# Altium project thesis_motherboard.PrjPcb
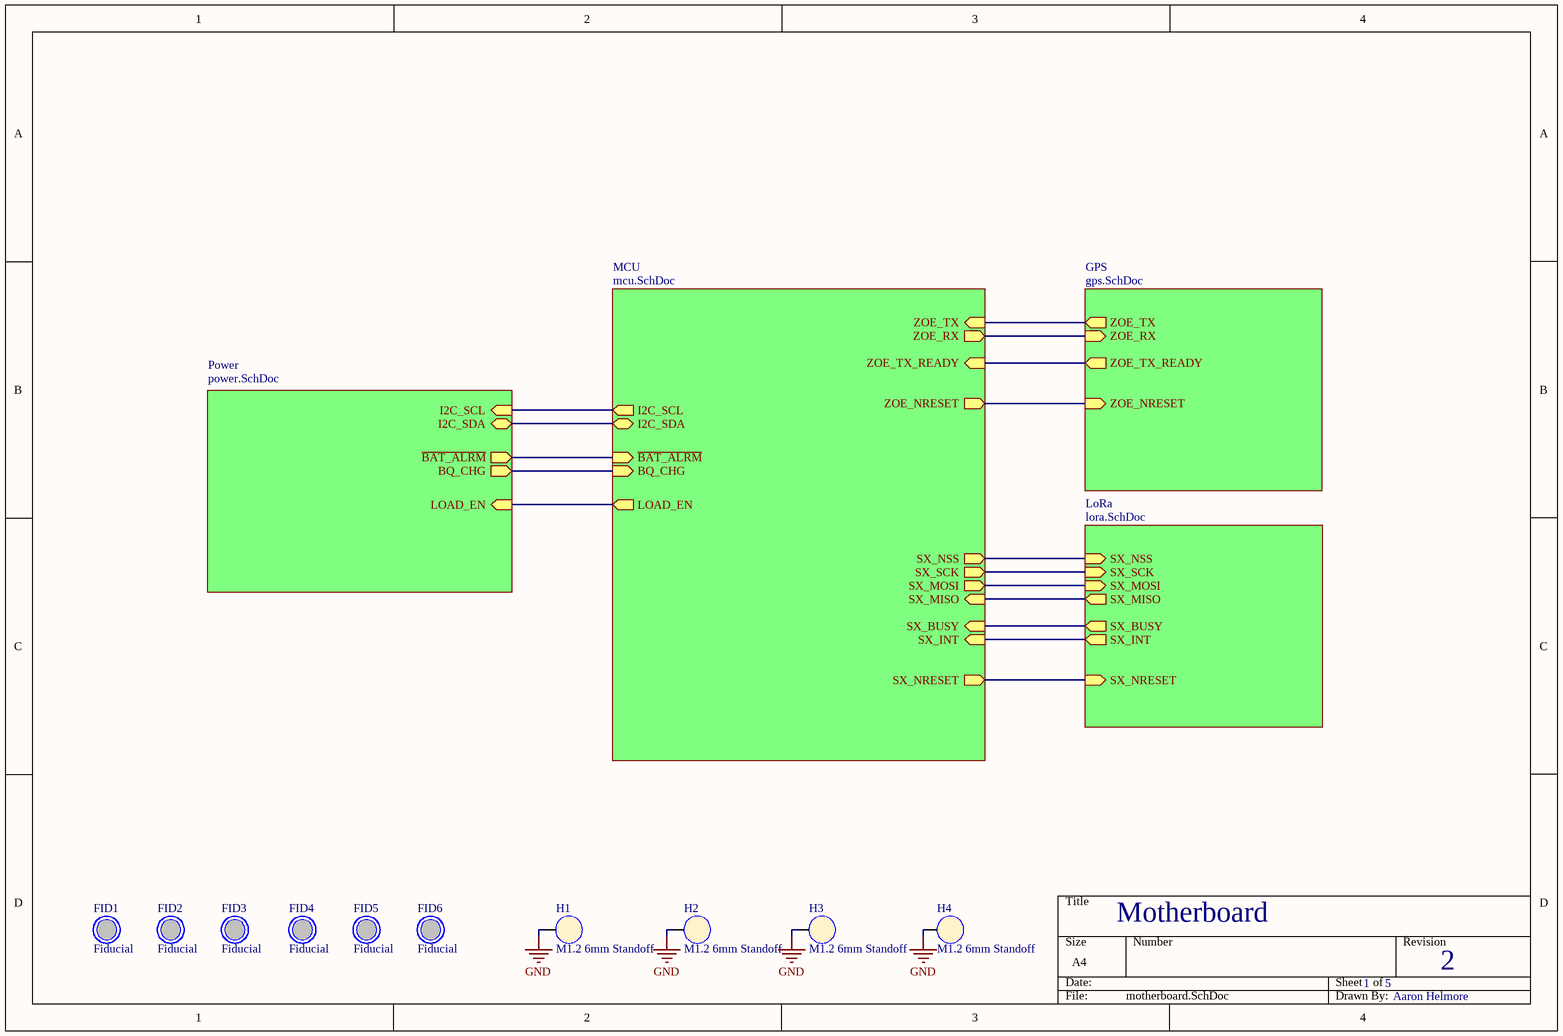
[diagram p0: motherboard.SchDoc]
5 sheets, 94 parts. Net scope: hierarchical (ports join the sheet entries above them; power ports are global).
Board files: motherboard.PcbDoc, motherboardx1.PcbDoc
Sheets:
  motherboard.SchDoc
    MCU = mcu.SchDoc
    GPS = gps.SchDoc
    LoRa = lora.SchDoc
    Power = power.SchDoc

## Sheet motherboard.SchDoc
size A4; DocumentNumber: P21; SheetNumber: 1; SheetTotal: 5

### Parts
FID1  Fiducial  [FIDUCIAL_0.5MM_SOLDER_1MM_MASK]
FID2  Fiducial  [FIDUCIAL_0.5MM_SOLDER_1MM_MASK]
FID3  Fiducial  [FIDUCIAL_0.5MM_SOLDER_1MM_MASK]
FID4  Fiducial  [FIDUCIAL_0.5MM_SOLDER_1MM_MASK]
FID5  Fiducial  [FIDUCIAL_0.5MM_SOLDER_1MM_MASK]
FID6  Fiducial  [FIDUCIAL_0.5MM_SOLDER_1MM_MASK]
H1  M1.2 6mm Standoff  [M1.2_6mm_STANDOFF]
H2  M1.2 6mm Standoff  [M1.2_6mm_STANDOFF]
H3  M1.2 6mm Standoff  [M1.2_6mm_STANDOFF]
H4  M1.2 6mm Standoff  [M1.2_6mm_STANDOFF]

### Sub-sheets
GPS = gps.SchDoc: ZOE_TX (out), ZOE_RX (in), ZOE_TX_READY (out), ZOE_NRESET (in)
LoRa = lora.SchDoc: SX_NSS (in), SX_SCK (in), SX_MOSI (in), SX_MISO (out), SX_BUSY (out), SX_NRESET (in), SX_INT (out)
MCU = mcu.SchDoc: LOAD_EN (out), BQ_CHG (in), ~{BAT_ALRM} (in), I2C_SCL (out), I2C_SDA (bidir), ZOE_TX (in), ZOE_RX (out), ZOE_TX_READY (in), ZOE_NRESET (out), SX_NRESET (out), SX_NSS (out), SX_MOSI (out), SX_SCK (out), SX_MISO (in), SX_BUSY (in), SX_INT (in)
Power = power.SchDoc: BQ_CHG (out), LOAD_EN (in), ~{BAT_ALRM} (out), I2C_SCL (in), I2C_SDA (bidir)

### Nets
GND: H1.1(VCC) H2.1(VCC) H3.1(VCC) H4.1(VCC)
ALRM: sheet MCU/~{BAT_ALRM}, sheet Power/~{BAT_ALRM}
~{CHG}: sheet MCU/BQ_CHG, sheet Power/BQ_CHG
EN: sheet MCU/LOAD_EN, sheet Power/LOAD_EN
HAT_I2C_SCL: sheet MCU/I2C_SCL, sheet Power/I2C_SCL
HAT_I2C_SDA: sheet MCU/I2C_SDA, sheet Power/I2C_SDA
SX_BUSY: sheet MCU/SX_BUSY, sheet LoRa/SX_BUSY
SX_INT: sheet MCU/SX_INT, sheet LoRa/SX_INT
SX_MISO: sheet MCU/SX_MISO, sheet LoRa/SX_MISO
SX_MOSI: sheet MCU/SX_MOSI, sheet LoRa/SX_MOSI
SX_NRESET: sheet MCU/SX_NRESET, sheet LoRa/SX_NRESET
SX_NSS: sheet MCU/SX_NSS, sheet LoRa/SX_NSS
SX_SCK: sheet MCU/SX_SCK, sheet LoRa/SX_SCK
ZOE_NRESET: sheet MCU/ZOE_NRESET, sheet GPS/ZOE_NRESET
ZOE_RX: sheet MCU/ZOE_RX, sheet GPS/ZOE_RX
ZOE_TX: sheet MCU/ZOE_TX, sheet GPS/ZOE_TX
ZOE_TX_READY: sheet MCU/ZOE_TX_READY, sheet GPS/ZOE_TX_READY

### Notes on the sheet
- Motherboard
- 1
- 5
- 2
- Aaron Helmore

## Sheet mcu.SchDoc
size A4; DocumentNumber: P22; SheetNumber: 2; SheetTotal: 5
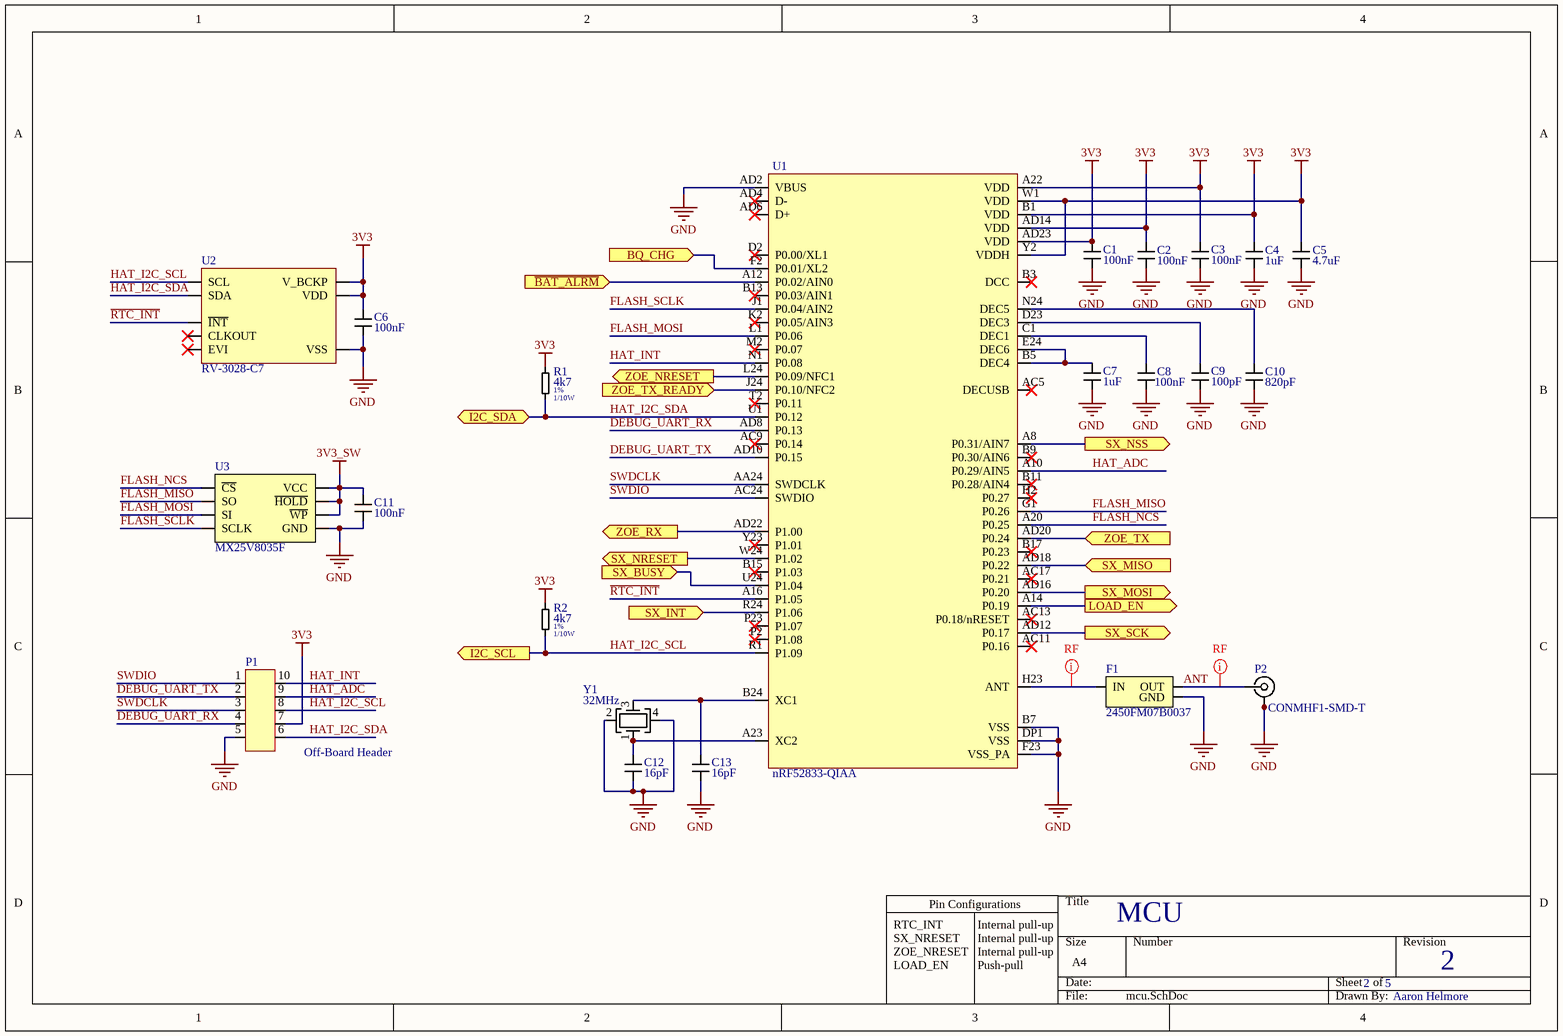
[diagram p1: mcu.SchDoc]

### Parts
C1  100nF  [CAP_0402]
C2  100nF  [CAP_0402]
C3  100nF  [CAP_0402]
C4  1uF  [CAP_0402]
C5  4.7uF  [CAP_0603]
C6  100nF  [CAP_0402]
C7  1uF  [CAP_0402]
C8  100nF  [CAP_0402]
C9  100pF  [CAP_0402]
C10  820pF  [CAP_0402]
C11  100nF  [CAP_0402]
C12  16pF  [CAP_0402]
C13  16pF  [CAP_0402]
F1  2450FM07B0037  [2450FM07B0037]
P1  Off-Board Header  [1_27-5x2-MALE-HEADER]
P2  CONMHF1-SMD-T  [CONMHF1-SMD-T]
R1  4k7  Tolerance: 1%  Wattage: 1/10W  [RES_0402]
R2  4k7  Tolerance: 1%  Wattage: 1/10W  [RES_0402]
U1  nRF52833-QIAA  [nRF52833-QIAA]
U2  RV-3028-C7  [RV-3028-C7]
U3  MX25V8035F  [MX25V8035F]
Y1  32MHz  [4-SMD]

### Ports
BQ_CHG (in), I2C_SCL (out), I2C_SDA (bidir), LOAD_EN (out), SX_BUSY (in), SX_INT (in), SX_MISO (in), SX_MOSI (out), SX_NRESET (out), SX_NSS (out), SX_SCK (out), ZOE_NRESET (out), ZOE_RX (out), ZOE_TX (in), ZOE_TX_READY (in), ~{BAT_ALRM} (in)

### Nets
3V3: C1.2(J11) C2.2(J11) C3.2(J11) C4.2(J11) C5.2(J11) C6.2(J11) P1.7 R1.1 R2.1 U1.A22(VDD) U1.AD14(VDD) U1.AD23(VDD) U1.B1(VDD) U1.W1(VDD) U1.Y2(VDDH) U2.6(V_BCKP) U2.7(VDD)
3V3_SW: C11.2(J11) U3.3(~{WP}) U3.7(~{HOLD}) U3.8(VCC)
GND: C1.1(J12) C2.1(J12) C3.1(J12) C4.1(J12) C5.1(J12) C6.1(J12) C7.1(J12) C8.1(J12) C9.1(J12) C10.1(J12) C11.1(J12) C12.1(J12) C13.1(J12) F1.2(GND) P1.5 P2.2(VCC) P2.3(VCC) P2.4(VCC) U1.AD2(VBUS) U1.B7(VSS) U1.DP1(VSS) U1.F23(VSS_PA) U2.5(VSS) U3.4(GND) Y1.2 Y1.4
ALRM: U1.A12(P0.02/AIN0) ; port ~{BAT_ALRM}
ANT: F1.3(OUT) P2.1(VCC)
~{CHG}: U1.F2(P0.01/XL2) ; port BQ_CHG
DEBUG_UART_RX: P1.4 U1.AD8(P0.13)
DEBUG_UART_TX: P1.2 U1.AD10(P0.15)
EN: U1.A14(P0.19) ; port LOAD_EN
FLASH_MISO: U1.G1(P0.26) U3.2(SO)
FLASH_MOSI: U1.L1(P0.06) U3.5(SI)
FLASH_NCS: U1.A20(P0.25) U3.1(~{CS})
FLASH_SCLK: U1.J1(P0.04/AIN2) U3.6(SCLK)
HAT_ADC: P1.9 U1.A10(P0.29/AIN5)
HAT_I2C_SCL: P1.8 R2.2 U1.R1(P1.09) U2.3(SCL) ; port I2C_SCL
HAT_I2C_SDA: P1.6 R1.2 U1.U1(P0.12) U2.4(SDA) ; port I2C_SDA
HAT_INT: P1.10 U1.N1(P0.08)
~{RTC_INT}: U1.A16(P1.05) U2.2(~{INT})
SWDCLK: P1.3 U1.AA24(SWDCLK)
SWDIO: P1.1 U1.AC24(SWDIO)
SX_BUSY: U1.U24(P1.04) ; port SX_BUSY
SX_INT: U1.R24(P1.06) ; port SX_INT
SX_MISO: U1.AD18(P0.22) ; port SX_MISO
SX_MOSI: U1.AD16(P0.20) ; port SX_MOSI
SX_NRESET: U1.W24(P1.02) ; port SX_NRESET
SX_NSS: U1.A8(P0.31/AIN7) ; port SX_NSS
SX_SCK: U1.AD12(P0.17) ; port SX_SCK
ZOE_NRESET: U1.L24(P0.09/NFC1) ; port ZOE_NRESET
ZOE_RX: U1.AD22(P1.00) ; port ZOE_RX
ZOE_TX: U1.AD20(P0.24) ; port ZOE_TX
ZOE_TX_READY: U1.J24(P0.10/NFC2) ; port ZOE_TX_READY
NetC7_2: C7.2(J11) U1.B5(DEC4) U1.E24(DEC6)
NetC8_2: C8.2(J11) U1.C1(DEC1)
NetC9_2: C9.2(J11) U1.D23(DEC3)
NetC10_2: C10.2(J11) U1.N24(DEC5)
NetC12_2: C12.2(J11) U1.A23(XC2) Y1.1
NetC13_2: C13.2(J11) U1.B24(XC1) Y1.3
NetF1_1: F1.1(IN) U1.H23(ANT)

Not connected (* = marked no-connect by the designer): U1 AC5(DECUSB)* AC9(P0.14)* AC11(P0.16)* AC13(P0.18/nRESET)* AC17(P0.21)* AD4(D-)* AD6(D+)* B3(DCC)* B9(P0.30/AIN6)* B11(P0.28/AIN4)* B13(P0.03/AIN1)* B15(P1.03)* B17(P0.23)* D2(P0.00/XL1)* H2(P0.27)* K2(P0.05/AIN3)* M2(P0.07)* P2(P1.08)* P23(P1.07)* T2(P0.11)* Y23(P1.01)*; U2 1(CLKOUT)* 8(EVI)*

### Layout directives
rule Impedance Constraint [Min = 49.50    Max = 50.50    ]; net class NRF_RF_LINES: ANT, NetF1_1

### Notes on the sheet
- Pin Configurations
- RTC_INT
  SX_NRESET
  ZOE_NRESET
  LOAD_EN
- Internal pull-up
  Internal pull-up
  Internal pull-up
  Push-pull
- MCU
- 2
- 5
- Aaron Helmore

### Library data of the parts
C1-C4 C6-C8 C11 = Capacitor: Dielectric: X5R; Voltage: 25V
C5 = Capacitor: Dielectric: X5R; Voltage: 6.3V
C9 C10 C12 C13 = Capacitor: Dielectric: C0G; Voltage: 50V
F1 = 2450FM07B0037: Miniature 2.4GHz impedance matched low pass filter optimized for nRF52xxx
P1 = CONN_1-27_5x2: 1.27mm pitch 5x2 pin male connector
R1 R2 = R_Small
U1 = nRF52833-QIAA: BLE 5.1, Cortex M-4 SoC
U2 = RV-3028-C7: Extreme Low Power RTC Module
Y1 = Crystal_2_2

## Sheet gps.SchDoc
size A4; DocumentNumber: P24; SheetNumber: 4; SheetTotal: 5
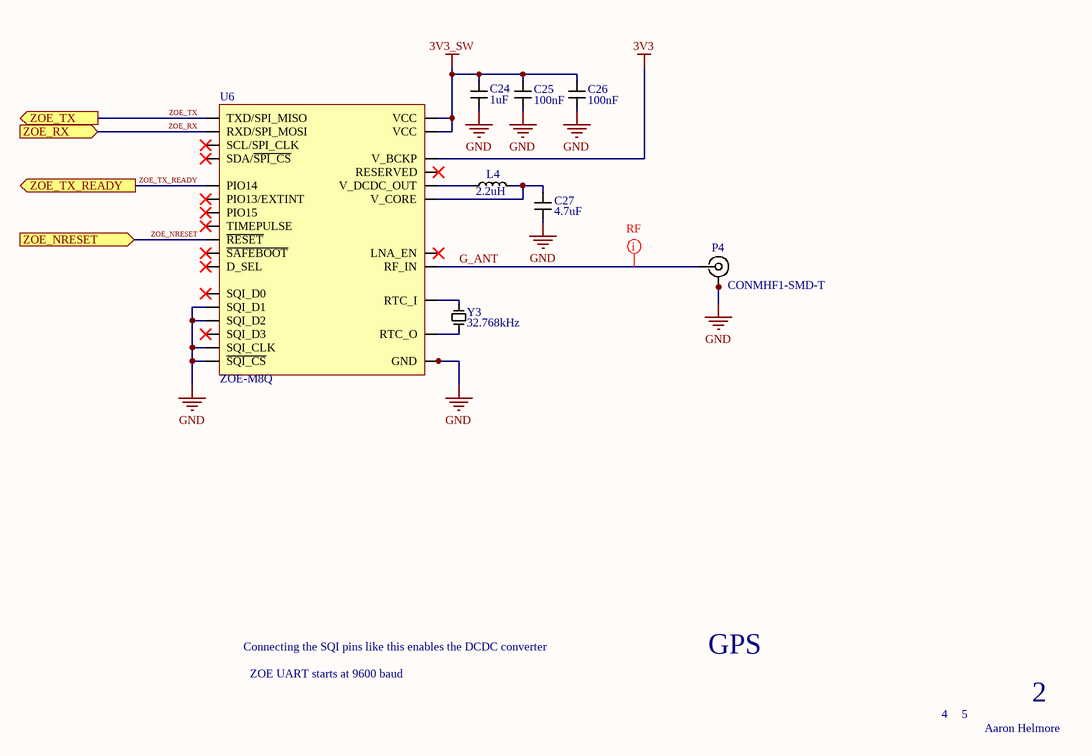
[diagram p2: gps.SchDoc]

### Parts
C24  1uF  [CAP_0402]
C25  100nF  [CAP_0402]
C26  100nF  [CAP_0402]
C27  4.7uF  [CAP_0603]
L4  2.2uH  [LQM2MPNxxxx]
P4  CONMHF1-SMD-T  [CONMHF1-SMD-T]
U6  ZOE-M8Q  [ZOE-M8Q]
Y3  32.768kHz  [2-SMD]

### Ports
ZOE_NRESET (in), ZOE_RX (in), ZOE_TX (out), ZOE_TX_READY (out)

### Nets
3V3: U6.H9(V_BCKP)
3V3_SW: C24.2(J11) C25.2(J11) C26.2(J11) U6.J1(VCC) U6.J2(VCC)
GND: C24.1(J12) C25.1(J12) C26.1(J12) C27.1(J12) P4.2(VCC) P4.3(VCC) P4.4(VCC) U6.A1(GND) U6.A3(GND) U6.A5(GND) U6.A7(GND) U6.A8(GND) U6.A9(GND) U6.B9(GND) U6.C1(SQI_D1) U6.C7(GND) U6.C9(GND) U6.D3(~{SQI_CS}) U6.D6(GND) U6.D9(GND) U6.E1(SQI_CLK) U6.E3(SQI_D2) U6.E7(GND) U6.F7(GND) U6.G3(GND) U6.G6(GND) U6.G7(GND) U6.J3(GND) U6.J9(GND)
G_ANT: P4.1(VCC) U6.A4(RF_IN)
ZOE_NRESET: U6.J6(~{RESET}) ; port ZOE_NRESET
ZOE_RX: U6.J4(RXD/SPI_MOSI) ; port ZOE_RX
ZOE_TX: U6.J5(TXD/SPI_MISO) ; port ZOE_TX
ZOE_TX_READY: U6.F6(PIO14) ; port ZOE_TX_READY
NetC27_2: C27.2(J11) L4.2 U6.G1(V_CORE)
NetL4_1: L4.1 U6.H1(V_DCDC_OUT)
NetU6_J7: U6.J7(RTC_I) Y3.2
NetU6_J8: U6.J8(RTC_O) Y3.1

Not connected (* = marked no-connect by the designer): U6 A2(SDA/~{SPI_CS})* B1(SCL/SPI_CLK)* C3(TIMEPULSE)* C4(~{SAFEBOOT})* C5(LNA_EN)* C6(PIO15)* D1(SQI_D0)* D4(D_SEL)* F3(SQI_D3)* G4(PIO13/EXTINT)* G9(RESERVED)*

### Layout directives
rule Impedance Constraint [Min = 49.50    Max = 50.50    ]; net class ZOE_RF_LINES: G_ANT

### Notes on the sheet
- Connecting the SQI pins like this enables the DCDC converter
- ZOE UART starts at 9600 baud
- GPS
- 4
- 5
- 2
- Aaron Helmore

### Library data of the parts
C24-C26 = Capacitor: Dielectric: X5R; Voltage: 25V
C27 = Capacitor: Dielectric: X5R; Voltage: 6.3V
L4 = Inductor
U6 = ZOE-M8Q: ublox GPS/GNSS receiver
Y3 = Crystal_2_1

## Sheet lora.SchDoc
size A4; DocumentNumber: P23; SheetNumber: 3; SheetTotal: 5
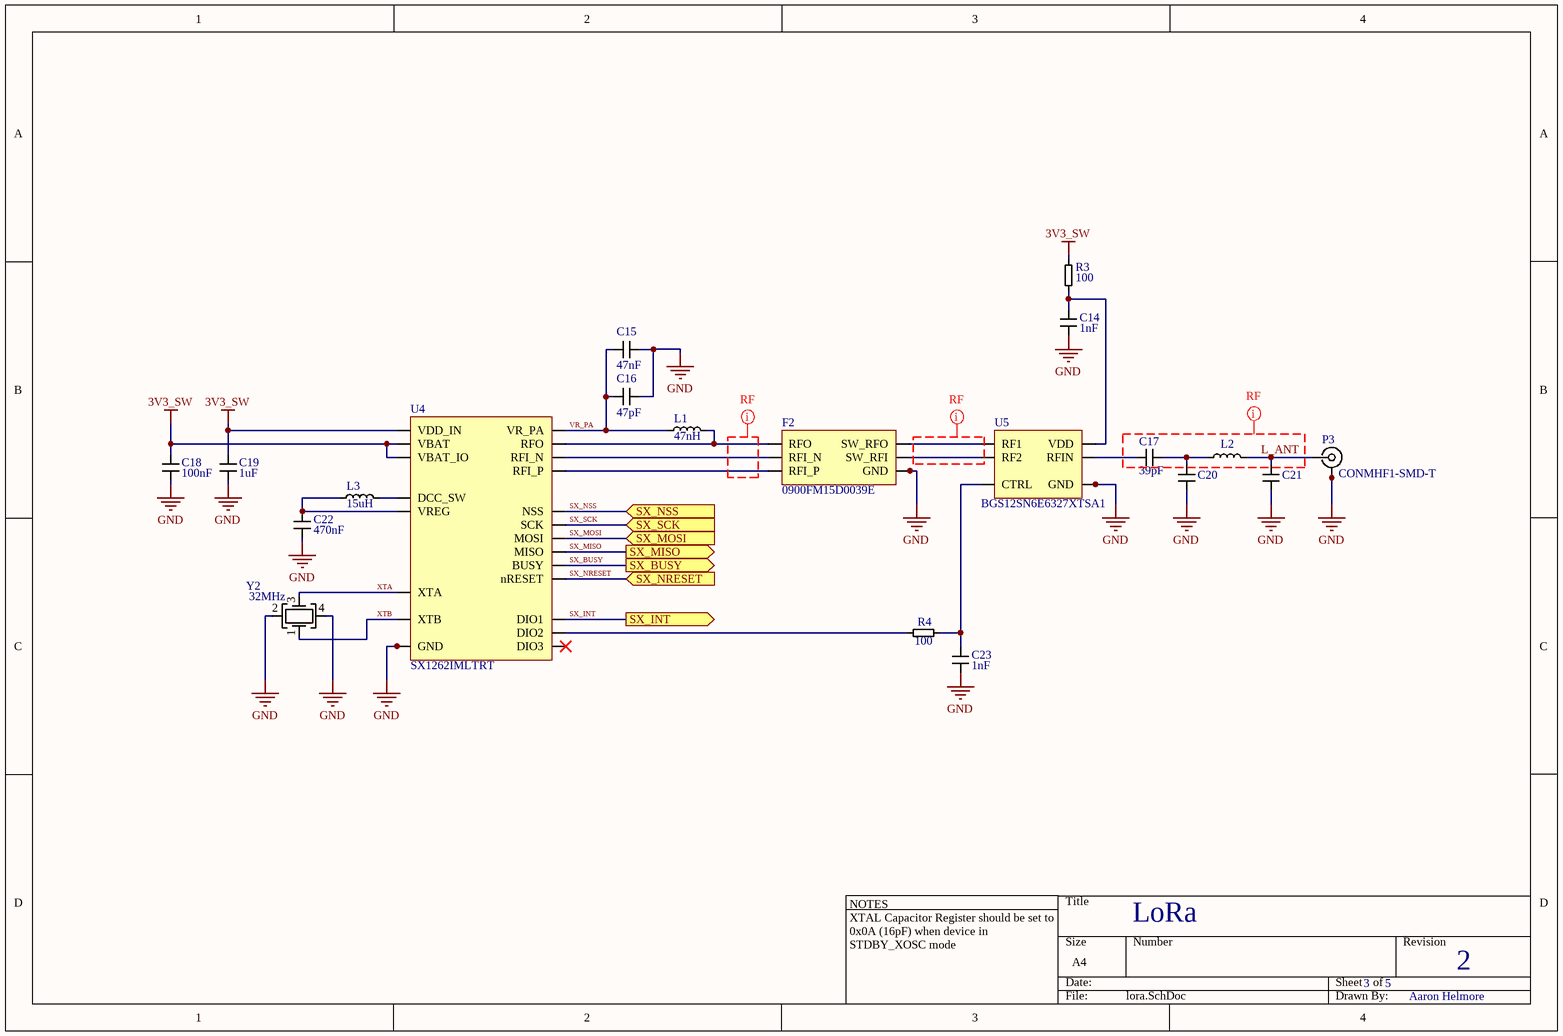
[diagram p3: lora.SchDoc]

### Parts
C14  1nF  [CAP_0402]
C15  47nF  [CAP_0402]
C16  47pF  [CAP_0402]
C17  39pF  [CAP_0402]
C18  100nF  [CAP_0402]
C19  1uF  [CAP_0402]
C20  Capacitor  [CAP_0402]  (value not drawn)
C21  Capacitor  [CAP_0402]  (value not drawn)
C22  470nF  [CAP_0603]
C23  1nF  [CAP_0402]
F2  0900FM15D0039E  [0900FM15D0039E]
L1  47nH  [LQW15AN]
L2  Inductor  [RES_0402]  (value not drawn)
L3  15uH  [VLS2010ET-150M]
P3  CONMHF1-SMD-T  [CONMHF1-SMD-T]
R3  100  [RES_0402]
R4  100  [RES_0402]
U4  SX1262IMLTRT  [SX1262IMLTRT]
U5  BGS12SN6E6327XTSA1  [BGS12SN6E6327XTSA1]
Y2  32MHz  [4-SMD]

### Ports
SX_BUSY (out), SX_INT (out), SX_MISO (out), SX_MOSI (in), SX_NRESET (in), SX_NSS (in), SX_SCK (in)

### Nets
3V3_SW: C18.2(J11) C19.1(J12) R3.1 U4.1(VDD_IN) U4.10(VBAT) U4.11(VBAT_IO)
GND: C14.1(J12) C15.1(J12) C16.1(J12) C18.1(J12) C19.2(J11) C20.1(J12) C21.1(J12) C22.1(J12) C23.1(J12) F2.2(GND) F2.5(GND) F2.7(GND) F2.9(GND) F2.10(GND) P3.2(VCC) P3.3(VCC) P3.4(VCC) U4.0(GND) U4.2(GND) U4.5(GND) U4.8(GND) U4.20(GND) U5.2(GND) Y2.2 Y2.4
L_ANT: C21.2(J11) L2.2 P3.1(VCC)
SX_BUSY: U4.14(BUSY) ; port SX_BUSY
SX_INT: U4.13(DIO1) ; port SX_INT
SX_MISO: U4.16(MISO) ; port SX_MISO
SX_MOSI: U4.17(MOSI) ; port SX_MOSI
SX_NRESET: U4.15(nRESET) ; port SX_NRESET
SX_NSS: U4.19(NSS) ; port SX_NSS
SX_SCK: U4.18(SCK) ; port SX_SCK
VR_PA: C15.2(J11) C16.2(J11) L1.1 U4.24(VR_PA)
XTA: U4.3(XTA) Y2.3
XTB: U4.4(XTB) Y2.1
NetC14_2: C14.2(J11) R3.2 U5.4(VDD)
NetC17_1: C17.1(J12) U5.5(RFIN)
NetC17_2: C17.2(J11) C20.2(J11) L2.1
NetC22_2: C22.2(J11) L3.1 U4.7(VREG)
NetC23_2: C23.2(J11) R4.2 U5.6(CTRL)
NetF2_1: F2.1(RFO) L1.2 U4.23(RFO)
NetF2_3: F2.3(RFI_N) U4.22(RFI_N)
NetF2_4: F2.4(RFI_P) U4.21(RFI_P)
NetF2_6: F2.6(SW_RFI) U5.1(RF2)
NetF2_8: F2.8(SW_RFO) U5.3(RF1)
NetL3_2: L3.2 U4.9(DCC_SW)
NetR4_1: R4.1 U4.12(DIO2)

Not connected (* = marked no-connect by the designer): U4 6(DIO3)*

### Layout directives
rule Impedance Constraint [Min = 49.50    Max = 50.50    ]; net class SX_RF_LINES: (no net found under the mark), L_ANT

### Notes on the sheet
- NOTES
  XTAL Capacitor Register should be set to 0x0A (16pF) when device in STDBY_XOSC mode
- LoRa
- 3
- 5
- 2
- Aaron Helmore

### Library data of the parts
C14 C23 = Capacitor: Dielectric: X7R; Voltage: 50V
C15 C22 = Capacitor: Dielectric: X7R; Voltage: 25V
C16 C17 = Capacitor: Dielectric: C0G; Voltage: 50V
C18 C19 = Capacitor: Dielectric: X5R; Voltage: 25V
F2 = 0900FM15D0039E: Miniature impedance-matched filter for Semtech SX1261/SX1262 for 915MHz operation
L1 L3 = Inductor
R3 R4 = R_Small: Tolerance: 1%; Wattage: 1/4W
U4 = SX1262IMLTRT: Semtech LoRa radio transceivers
Y2 = Crystal_2_2

## Sheet power.SchDoc
size A4; DocumentNumber: P25; SheetNumber: 5; SheetTotal: 5
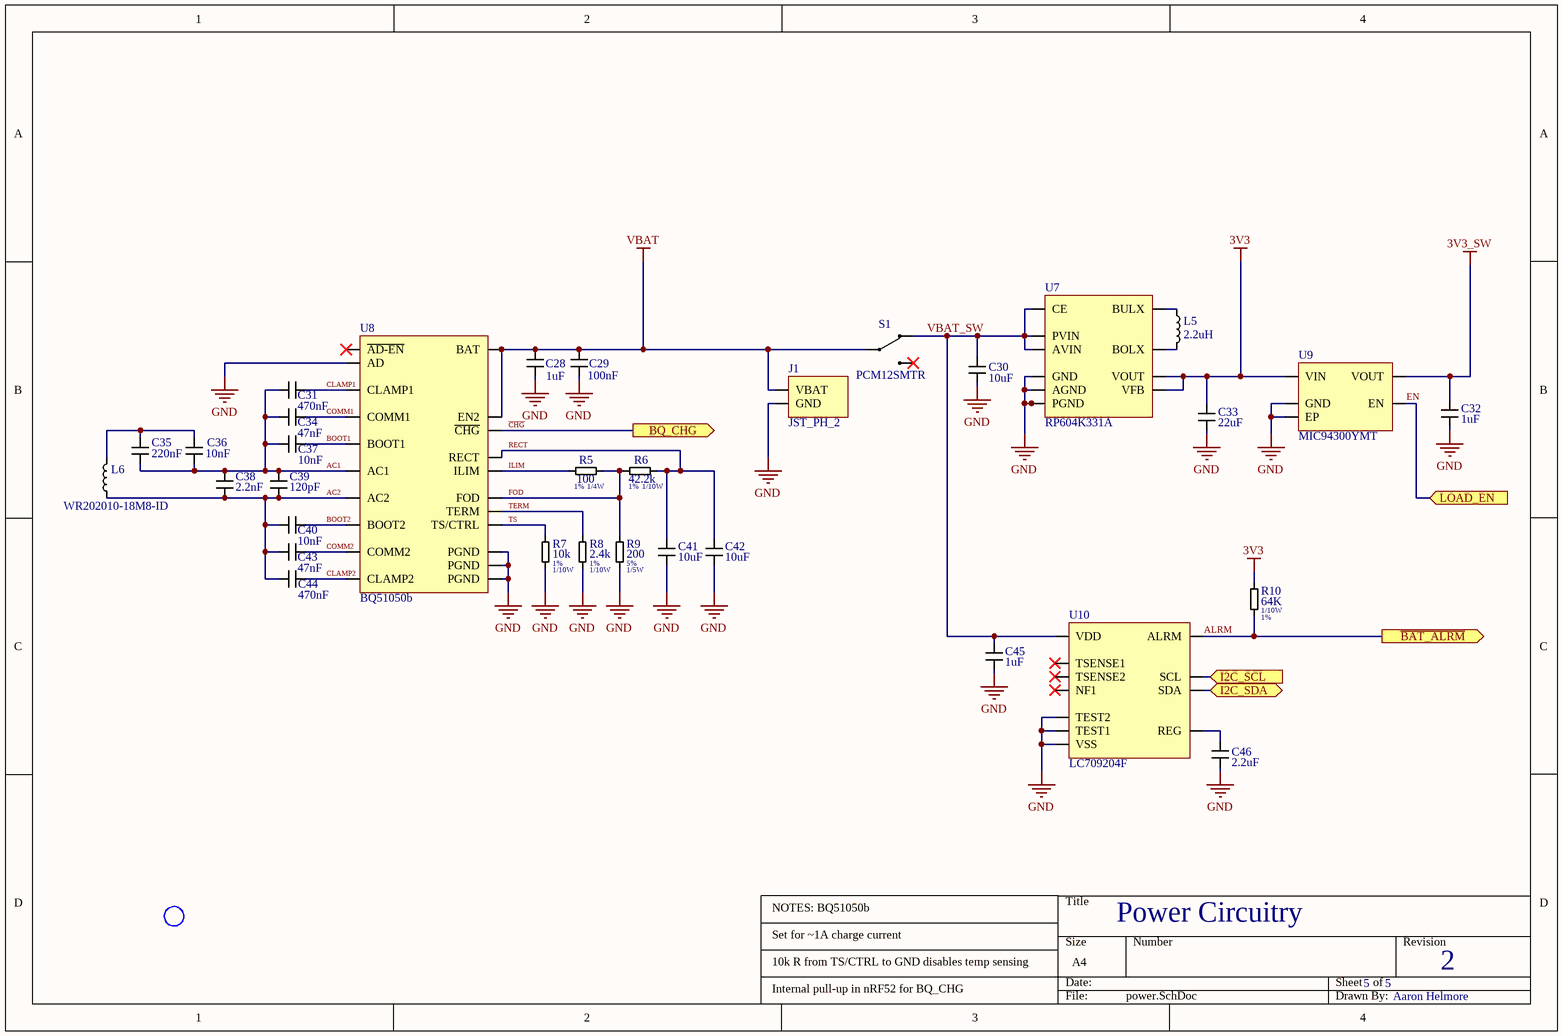
[diagram p4: power.SchDoc]

### Parts
C28  1uF  [CAP_0402]
C29  100nF  [CAP_0402]
C30  10uF  [CAP_0603]
C31  470nF  [CAP_0603]
C32  1uF  [CAP_0402]
C33  22uF  [CAP_0603]
C34  47nF  [CAP_0402]
C35  220nF  [CAP_0402]
C36  10nF  [CAP_0402]
C37  10nF  [CAP_0402]
C38  2.2nF  [CAP_0402]
C39  120pF  [CAP_0402]
C40  10nF  [CAP_0402]
C41  10uF  [CAP_0603]
C42  10uF  [CAP_0603]
C43  47nF  [CAP_0402]
C44  470nF  [CAP_0603]
C45  1uF  [CAP_0402]
C46  2.2uF  [CAP_0603]
J1  JST_PH_2  [JST PH2 SMT]
L5  2.2uH  [LQM2MPNxxxx]
L6  WR202010-18M8-ID  [WR202010]
R5  100  Tolerance: 1%  Wattage: 1/4W  [RES_0402]
R6  42.2k  Tolerance: 1%  Wattage: 1/10W  [RES_0402]
R7  10k  Tolerance: 1%  Wattage: 1/10W  [RES_0402]
R8  2.4k  Tolerance: 1%  Wattage: 1/10W  [RES_0402]
R9  200  Tolerance: 5%  Wattage: 1/5W  [RES_0402]
R10  64K  Wattage: 1/10W  Tolerance: 1%  [RES_0402]
RXCOIL1  RXCOIL_MISC  [RX_COIL_MISC]  (value not drawn)
S1  PCM12SMTR  [PCM12SMTR]
U7  RP604K331A  [UDFN-12]
U8  BQ51050b  [BQ51050b-VQFN]
U9  MIC94300YMT  [MIC94300YMT]
U10  LC709204F  [LC709204F]

### Ports
BQ_CHG (out), I2C_SCL (in), I2C_SDA (bidir), LOAD_EN (in), ~{BAT_ALRM} (out)

### Nets
3V3: C33.2(J11) R10.1 U7.6(VFB) U7.7(VOUT) U9.4(VIN)
3V3_SW: C32.2(J11) U9.3(VOUT)
GND: C28.1(J12) C29.1(J12) C30.1(J12) C32.1(J12) C33.1(J12) C41.1(J12) C42.1(J12) C45.1(J12) C46.1(J12) J1.2(GND) R7.2 R8.2 R9.2 U7.3(PGND) U7.4(PGND) U7.5(AGND) U7.9(PGND) U7.10(PGND) U7.13(GND) U8.0(PGND) U8.1(PGND) U8.9(AD) U8.20(PGND) U9.2(GND) U9.EP1(EP) U10.A2(VSS) U10.B2(TEST2) U10.C2(TEST1)
VBAT: C28.2(J11) C29.2(J11) J1.1(VBAT) S1.2 U8.4(BAT) U8.11(EN2)
AC1: C31.2(J11) C34.2(J11) C35.1(J12) C36.1(J12) C37.1(J12) C38.2(J11) C39.2(J11) U8.2(AC1)
AC2: C38.1(J12) C39.1(J12) C40.2(J11) C43.2(J11) C44.2(J11) L6.1 U8.19(AC2)
ALRM: R10.2 U10.C1(ALRM) ; port ~{BAT_ALRM}
BOOT1: C37.2(J11) U8.3(BOOT1)
BOOT2: C40.1(J12) U8.17(BOOT2)
~{CHG}: U8.7(~{CHG}) ; port BQ_CHG
CLAMP1: C31.1(J12) U8.5(CLAMP1)
CLAMP2: C44.1(J12) U8.16(CLAMP2)
COMM1: C34.1(J12) U8.6(COMM1)
COMM2: C43.1(J12) U8.15(COMM2)
EN: U9.1(EN) ; port LOAD_EN
FOD: R5.2 R6.1 R9.1 U8.14(FOD)
HAT_I2C_SCL: U10.A1(SCL) ; port I2C_SCL
HAT_I2C_SDA: U10.B1(SDA) ; port I2C_SDA
ILIM: R5.1 U8.12(ILIM)
RECT: C41.2(J11) C42.2(J11) R6.2 U8.18(RECT)
TERM: R8.1 U8.10(TERM)
TS: R7.1 U8.13(TS/CTRL)
VBAT_SW: C30.2(J11) C45.2(J11) S1.1 U7.1(AVIN) U7.2(CE) U7.12(PVIN) U10.A4(VDD)
NetC35_2: C35.2(J11) C36.2(J11) L6.2
NetC46_2: C46.2(J11) U10.A3(REG)
NetL5_1: L5.1 U7.11(BULX)
NetL5_2: L5.2 U7.8(BOLX)

Not connected (* = marked no-connect by the designer): S1 3*; U8 8(~{AD-EN})*; U10 B3(TSENSE2)* B4(TSENSE1)* C3(NF1)*

### Notes on the sheet
- Power Circuitry
- 5
- 2
- NOTES: BQ51050b
  Set for ~1A charge current
  10k R from TS/CTRL to GND disables temp sensing
  Internal pull-up in nRF52 for BQ_CHG
- Aaron Helmore

### Library data of the parts
C28-C30 C32 C35 C41 C42 C45 C46 = Capacitor: Dielectric: X5R; Voltage: 25V
C31 C34 C36 C37 C40 C43 C44 = Capacitor: Dielectric: X7R; Voltage: 25V
C33 = Capacitor: Dielectric: X5R; Voltage: 10V
C38 C39 = Capacitor: Dielectric: X7R; Voltage: 50V
J1 = JST_PH_2: JST PH series connector with 2 pins 1 row
L5 L6 = Inductor
R5-R10 = R_Small
S1 = PCM12SMTR: CK Switches 300mA 6VDC SMT right-angle slide switch
U7 = RP604K331A: Nisshinbo Ultra-low quiescent current, 300mA, Buck-Boost DC/DC converter
U8 = BQ51050b: Single stage wireless power receiver and Li-Ion/Li-Pol battery charger. Qi compatible
U9 = MIC94300YMT: 200mA load switch
U10 = LC709204F: onsemi I2C Li-Ion/Li-Poly Fuel Gauge

## Nets that join several sheets
3V3: mcu (17 pins), gps (U6.H9), power (5 pins)
3V3_SW: mcu (C11.2 U3.3 U3.7 U3.8), gps (5 pins), lora (6 pins), power (C32.2 U9.3)
GND: motherboard (H1.1 H2.1 H3.1 H4.1), mcu (26 pins), gps (29 pins), lora (25 pins), power (28 pins)
ALRM: mcu (U1.A12), power (R10.2 U10.C1)
~{CHG}: mcu (U1.F2), power (U8.7)
EN: mcu (U1.A14), power (U9.1)
HAT_I2C_SCL: mcu (P1.8 R2.2 U1.R1 U2.3), power (U10.A1)
HAT_I2C_SDA: mcu (P1.6 R1.2 U1.U1 U2.4), power (U10.B1)
SX_BUSY: mcu (U1.U24), lora (U4.14)
SX_INT: mcu (U1.R24), lora (U4.13)
SX_MISO: mcu (U1.AD18), lora (U4.16)
SX_MOSI: mcu (U1.AD16), lora (U4.17)
SX_NRESET: mcu (U1.W24), lora (U4.15)
SX_NSS: mcu (U1.A8), lora (U4.19)
SX_SCK: mcu (U1.AD12), lora (U4.18)
ZOE_NRESET: mcu (U1.L24), gps (U6.J6)
ZOE_RX: mcu (U1.AD22), gps (U6.J4)
ZOE_TX: mcu (U1.AD20), gps (U6.J5)
ZOE_TX_READY: mcu (U1.J24), gps (U6.F6)